# EAGLE schematic M212X (EAGLE 6.6.0)
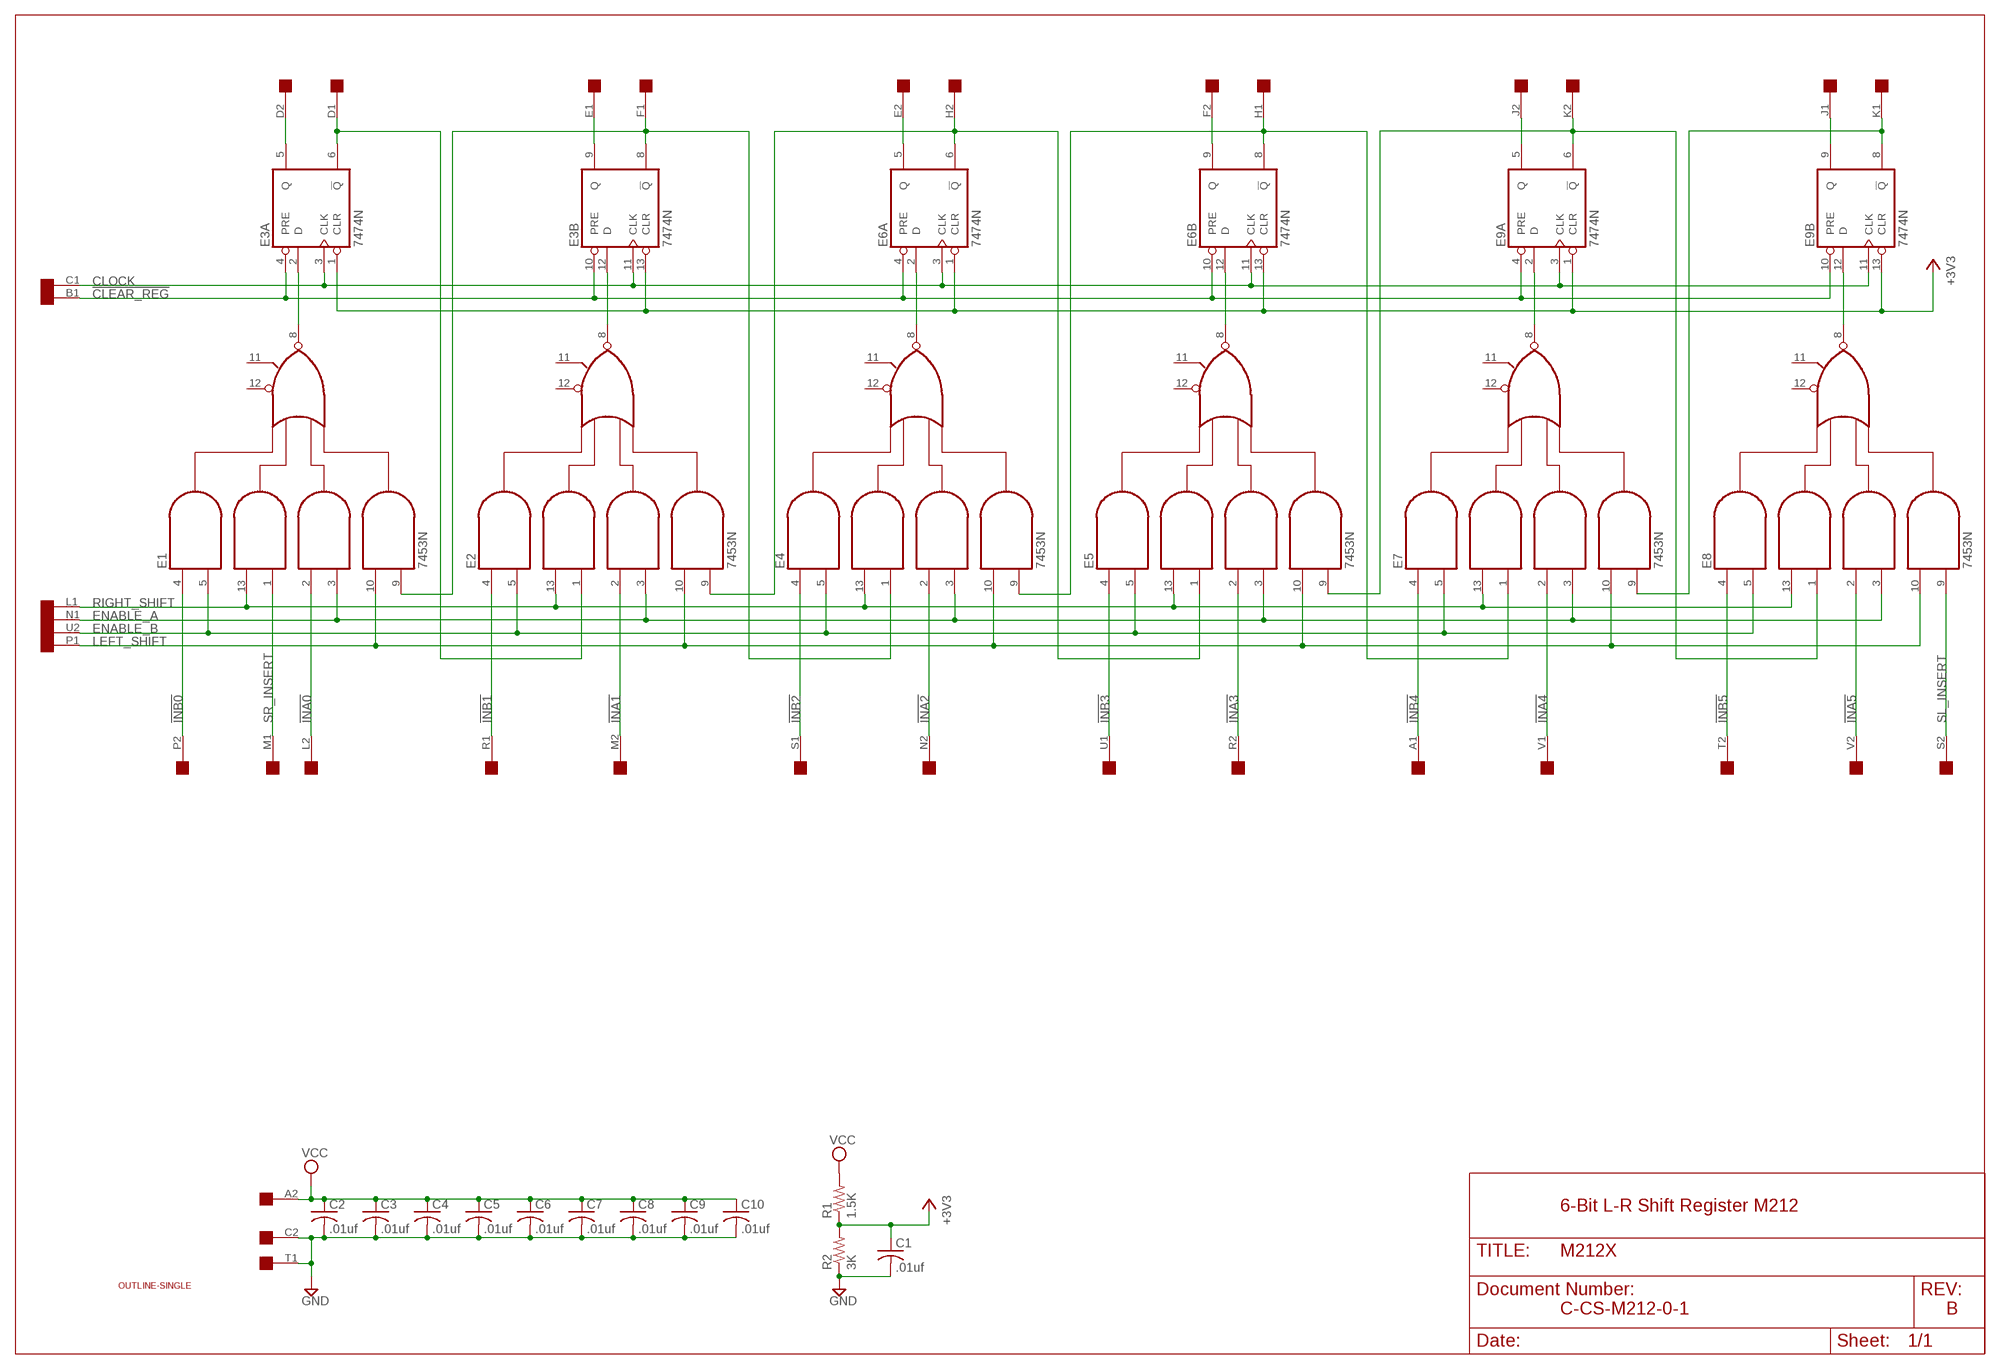
[diagram p0: schematic, sheet 1]

## Parts
C1  .01uf  C-US050-025X075  [C050-025X075]
C2  .01uf  C-US075-032X103  [C075-032X103]
C3  .01uf  C-US075-032X103  [C075-032X103]
C4  .01uf  C-US075-032X103  [C075-032X103]
C5  .01uf  C-US075-032X103  [C075-032X103]
C6  .01uf  C-US075-032X103  [C075-032X103]
C7  .01uf  C-US075-032X103  [C075-032X103]
C8  .01uf  C-US075-032X103  [C075-032X103]
C9  .01uf  C-US075-032X103  [C075-032X103]
C10  .01uf  C-US075-032X103  [C075-032X103]
E1  7453N  [DIL14]
E2  7453N  [DIL14]
E3  7474N  74S74N  [DIL14]
E4  7453N  [DIL14]
E5  7453N  [DIL14]
E6  7474N  74S74N  [DIL14]
E7  7453N  [DIL14]
E8  7453N  [DIL14]
E9  7474N  74S74N  [DIL14]
EDGE1  EDGE-2CONNECTOR  [EDGE-CON2]
R1  1.5K  R-US_0207/10  [0207/10]
R2  3K  R-US_0207/10  [0207/10]
U$1  OUTLINE-SINGLE  [SINGLE]

## Nets
!CLEAR_REG: E3.4(A:PRE) E3.10(B:PRE) E6.4(A:PRE) E6.10(B:PRE) E9.4(A:PRE) E9.10(B:PRE) EDGE1.B1
!INA0: E1.2(I5) EDGE1.L2
!INA1: E2.2(I5) EDGE1.M2
!INA2: E4.2(I5) EDGE1.N2
!INA3: E5.2(I5) EDGE1.R2
!INA4: E7.2(I5) EDGE1.V1
!INA5: E8.2(I5) EDGE1.V2
!INB0: E1.4(I1) EDGE1.P2
!INB1: E2.4(I1) EDGE1.R1
!INB2: E4.4(I1) EDGE1.S1
!INB3: E5.4(I1) EDGE1.U1
!INB4: E7.4(I1) EDGE1.A1
!INB5: E8.4(I1) EDGE1.T2
+3V3: C1.1 E3.1(A:CLR) E3.13(B:CLR) E6.1(A:CLR) E6.13(B:CLR) E9.1(A:CLR) E9.13(B:CLR) R1.1 R2.2
CLOCK: E3.3(A:CLK) E3.11(B:CLK) E6.3(A:CLK) E6.11(B:CLK) E9.3(A:CLK) E9.11(B:CLK) EDGE1.C1
ENABLE_A: E1.3(I6) E2.3(I6) E4.3(I6) E5.3(I6) E7.3(I6) E8.3(I6) EDGE1.N1
ENABLE_B: E1.5(I2) E2.5(I2) E4.5(I2) E5.5(I2) E7.5(I2) E8.5(I2) EDGE1.U2
GND [Supply]: C1.2 C2.2 C3.2 C4.2 C5.2 C6.2 C7.2 C8.2 C9.2 C10.2 EDGE1.C2 EDGE1.T1 R2.1
LEFT_SHIFT: E1.10(I7) E2.10(I7) E4.10(I7) E5.10(I7) E7.10(I7) E8.10(I7) EDGE1.P1
N$1: E1.8(O) E3.2(A:D)
N$2: E2.8(O) E3.12(B:D)
N$3: E4.8(O) E6.2(A:D)
N$4: E5.8(O) E6.12(B:D)
N$5: E7.8(O) E9.2(A:D)
N$6: E8.8(O) E9.12(B:D)
N$7: E3.5(A:Q) EDGE1.D2
N$8: E2.1(I4) E3.6(A:!Q) EDGE1.D1
N$9: E3.9(B:Q) EDGE1.E1
N$10: E1.9(I8) E3.8(B:!Q) E4.1(I4) EDGE1.F1
N$11: E6.5(A:Q) EDGE1.E2
N$12: E2.9(I8) E5.1(I4) E6.6(A:!Q) EDGE1.H2
N$13: E6.9(B:Q) EDGE1.F2
N$14: E4.9(I8) E6.8(B:!Q) E7.1(I4) EDGE1.H1
N$15: E9.5(A:Q) EDGE1.J2
N$16: E5.9(I8) E8.1(I4) E9.6(A:!Q) EDGE1.K2
N$17: E9.9(B:Q) EDGE1.J1
N$18: E7.9(I8) E9.8(B:!Q) EDGE1.K1
RIGHT_SHIFT: E1.13(I3) E2.13(I3) E4.13(I3) E5.13(I3) E7.13(I3) E8.13(I3) EDGE1.L1
SL_INSERT: E8.9(I8) EDGE1.S2
SR_INSERT: E1.1(I4) EDGE1.M1
VCC [Supply]: C2.1 C3.1 C4.1 C5.1 C6.1 C7.1 C8.1 C9.1 C10.1 EDGE1.A2 R1.2
Unconnected: E1.11(I10) E1.12(I9) E2.11(I10) E2.12(I9) E4.11(I10) E4.12(I9) E5.11(I10) E5.12(I9) E7.11(I10) E7.12(I9) E8.11(I10) E8.12(I9) EDGE1.B2

## Notes on the sheet
- 6-Bit L-R Shift Register M212
- C-CS-M212-0-1 | B

## Power pins joined to a net without a drawn wire
GND: E1.7(GND) E2.7(GND) E3.7(P:GND) E4.7(GND) E5.7(GND) E6.7(P:GND) E7.7(GND) E8.7(GND) E9.7(P:GND)
VCC: E1.14(VCC) E2.14(VCC) E3.14(P:VCC) E4.14(VCC) E5.14(VCC) E6.14(P:VCC) E7.14(VCC) E8.14(VCC) E9.14(P:VCC)

## Library data of the parts
C1-C10 = rcl:C-US: CAPACITOR, American symbol
E1 E2 E4 E5 E7 E8 = 74xxN:74*53: 4-2-3-2 input AND OR INVERTER gates
E3 E6 E9 = 74xx-us:74*74: Dual D type positive edge triggered FLIP FLOP, preset and clear
EDGE1 = dec-con:EDGE-2: Double-Sided DEC edge connector.
R1 R2 = rcl:R-US_: RESISTOR, American symbol
U$1 = dec-con:OUTLINE-*: Board outlines for DEC boards.

## Net classes
1 Supply: width 0.813 mm